# Altium schematic sheet trs.SchDoc
size A4
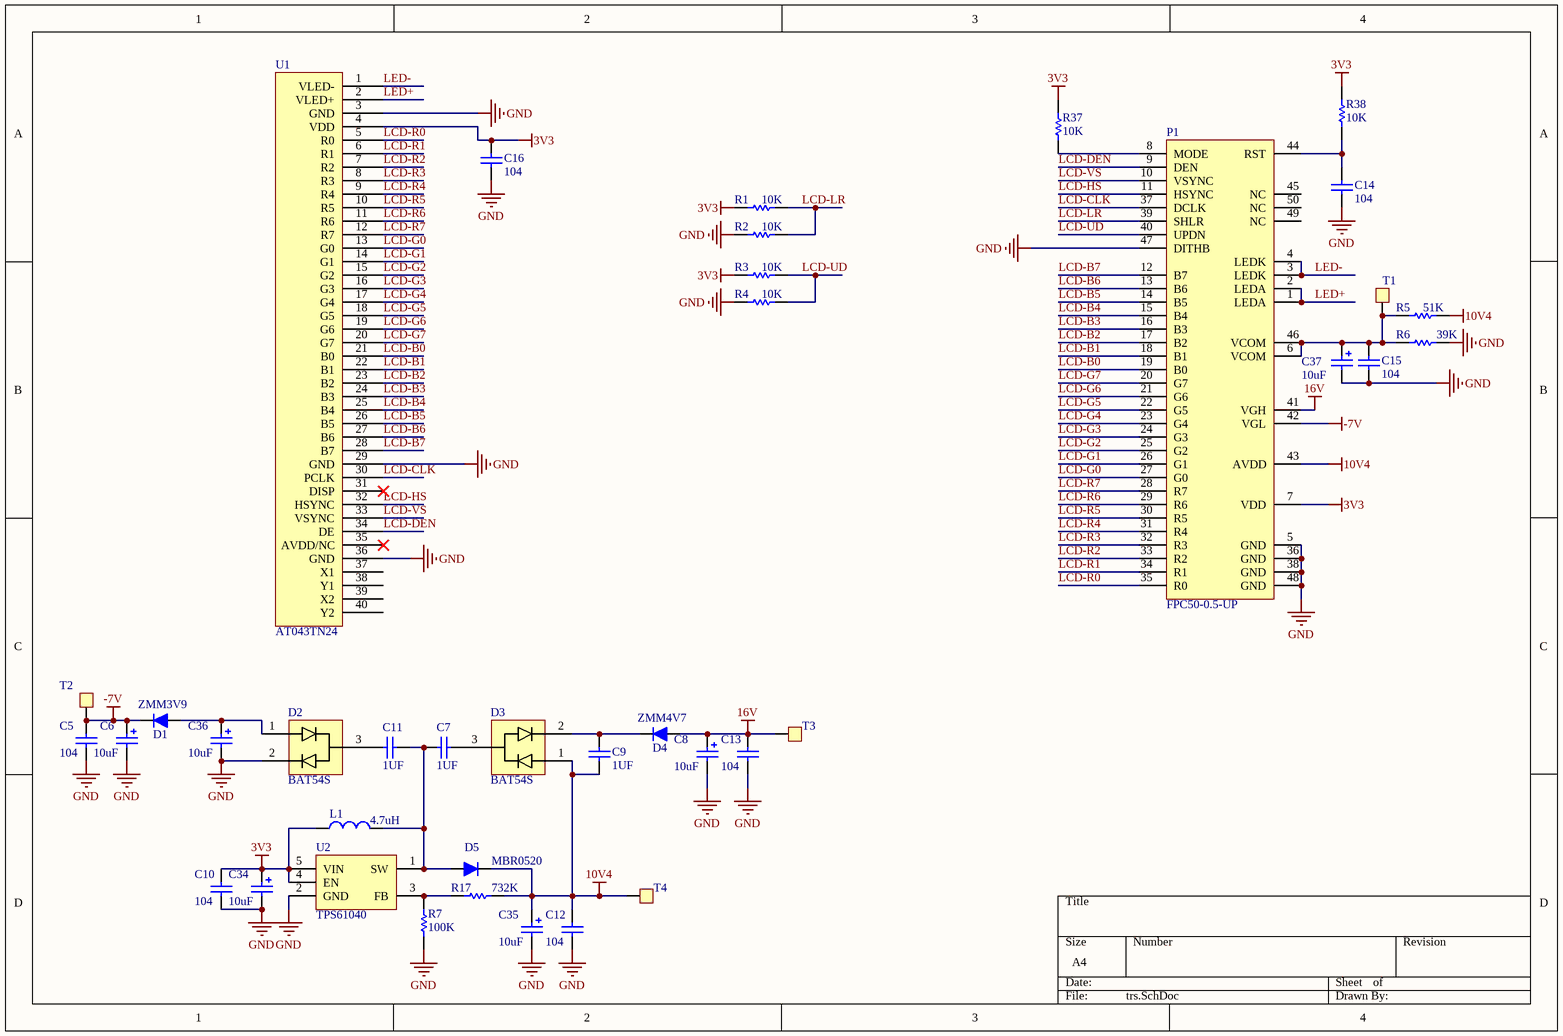
[diagram p0: trs.SchDoc]

## Parts
C5  104  [0603C]
C6  value 10uF  [0603C]  (hidden comment: C10uF)
C7  C1UF  [0603C]  (value not drawn)
C8  value 10uF  [0603C]  (hidden comment: C10uF)
C9  C1UF  [0603C]  (value not drawn)
C10  104  [0603C]
C11  C1UF  [0603C]  (value not drawn)
C12  104  [0603C]
C13  104  [0603C]
C14  104  [0603C]
C15  104  [0603C]
C16  104  [0603C]
C34  value 10uF  [0603C]  (hidden comment: C10uF)
C35  value 10uF  [0603C]  (hidden comment: C10uF)
C36  value 10uF  [0603C]  (hidden comment: C10uF)
C37  value 10uF  [0603C]  (hidden comment: C10uF)
D1  ZMM3V9  [LL34]
D2  BAT54S  [SOT-23-3]
D3  BAT54S  [SOT-23-3]
D4  ZMM4V7  [LL34]
D5  MBR0520  [SOD123]
L1  Inductor-4.7uH  [ins-443]  (value not drawn)
P1  FPC50-0.5-UP  [FPC50-0.5]
R1  10K  [0603R]
R2  10K  [0603R]
R3  10K  [0603R]
R4  10K  [0603R]
R5  51K  [0603R]
R6  39K  [0603R]
R7  100K  [0603R]
R17  R732K  [0603R]  (value not drawn)
R37  10K  [0603R]
R38  10K  [0603R]
T1  TP  [TEST_POINT]  (value not drawn)
T2  TP  [TEST_POINT]  (value not drawn)
T3  TP  [TEST_POINT]  (value not drawn)
T4  TP  [TEST_POINT]  (value not drawn)
U1  AT043TN24  [FPC40-N]
U2  TPS61040  [SOT23-5]

## Nets
3V3: C10.1 C16.2 C34.1 L1.1 P1.7(VDD) R1.2 R3.2 R37.2 R38.2 U1.4(VDD) U2.4(EN) U2.5(VIN)
10V4: C9.1 C12.1 C35.1 D3.1 D5.2(K) P1.43(AVDD) R5.1 R17.2 T4.1(R)
16V: C8.1 C13.1 D4.1(A) P1.41(VGH) T3.1(R)
-7V: C5.1 C6.1 D1.2(K) P1.42(VGL) T2.1(R)
GND: C5.2 C6.2 C8.2 C10.2 C12.2 C13.2 C14.1 C15.1 C16.1 C34.2 C35.2 C36.2 C37.2 D2.2 P1.5(GND) P1.36(GND) P1.38(GND) P1.47(DITHB) P1.48(GND) R2.2 R4.2 R6.1 R7.1 U1.3(GND) U1.29(GND) U1.36(GND) U2.2(GND)
LCD-B0: P1.19(B0) U1.21(B0)
LCD-B1: P1.18(B1) U1.22(B1)
LCD-B2: P1.17(B2) U1.23(B2)
LCD-B3: P1.16(B3) U1.24(B3)
LCD-B4: P1.15(B4) U1.25(B4)
LCD-B5: P1.14(B5) U1.26(B5)
LCD-B6: P1.13(B6) U1.27(B6)
LCD-B7: P1.12(B7) U1.28(B7)
LCD-CLK: P1.37(DCLK) U1.30(PCLK)
LCD-DEN: P1.9(DEN) U1.34(DE)
LCD-G0: P1.27(G0) U1.13(G0)
LCD-G1: P1.26(G1) U1.14(G1)
LCD-G2: P1.25(G2) U1.15(G2)
LCD-G3: P1.24(G3) U1.16(G3)
LCD-G4: P1.23(G4) U1.17(G4)
LCD-G5: P1.22(G5) U1.18(G5)
LCD-G6: P1.21(G6) U1.19(G6)
LCD-G7: P1.20(G7) U1.20(G7)
LCD-HS: P1.11(HSYNC) U1.32(HSYNC)
LCD-LR: P1.39(SHLR) R1.1 R2.1
LCD-R0: P1.35(R0) U1.5(R0)
LCD-R1: P1.34(R1) U1.6(R1)
LCD-R2: P1.33(R2) U1.7(R2)
LCD-R3: P1.32(R3) U1.8(R3)
LCD-R4: P1.31(R4) U1.9(R4)
LCD-R5: P1.30(R5) U1.10(R5)
LCD-R6: P1.29(R6) U1.11(R6)
LCD-R7: P1.28(R7) U1.12(R7)
LCD-UD: P1.40(UPDN) R3.1 R4.1
LCD-VS: P1.10(VSYNC) U1.33(VSYNC)
LED+: P1.1(LEDA) P1.2(LEDA) U1.2(VLED+)
LED-: P1.3(LEDK) P1.4(LEDK) U1.1(VLED-)
NetC7_1: C7.1 C11.2 D5.1(A) L1.2 U2.1(SW)
NetC7_2: C7.2 D3.3
NetC9_2: C9.2 D3.2 D4.2(K)
NetC11_1: C11.1 D2.3
NetC14_2: C14.2 P1.44(RST) R38.1
NetC15_2: C15.2 C37.1 P1.6(VCOM) P1.46(VCOM) R5.2 R6.2 T1.1(R)
NetC36_1: C36.1 D1.1(A) D2.1
NetP1_8: P1.8(MODE) R37.1
NetR7_2: R7.2 R17.1 U2.3(FB)

Not connected (* = marked no-connect by the designer): P1 45(NC) 49(NC) 50(NC); U1 31(DISP)* 35(AVDD/NC)* 37(X1) 38(Y1) 39(X2) 40(Y2)

## Notes on the sheet
- (in symbol C0.1uF) 1UF
- (in symbol Inductor-100uH) 4.7uH
- (in symbol R1M) 732K

## Library data of the parts
C5 C7 C9-C16 = C0.1uF
C6 C8 C34-C37 = Cap Pol1: Polarized Capacitor (Radial); Published: 8-Jun-2000; Revision: July-2002: Re-released for DXP Platform.; Publisher: Altium Limited
D1 D4 D5 = Diode
L1 = Inductor-100uH
P1 = LCD-7-50PIN
R1-R7 R17 R37 R38 = R1M